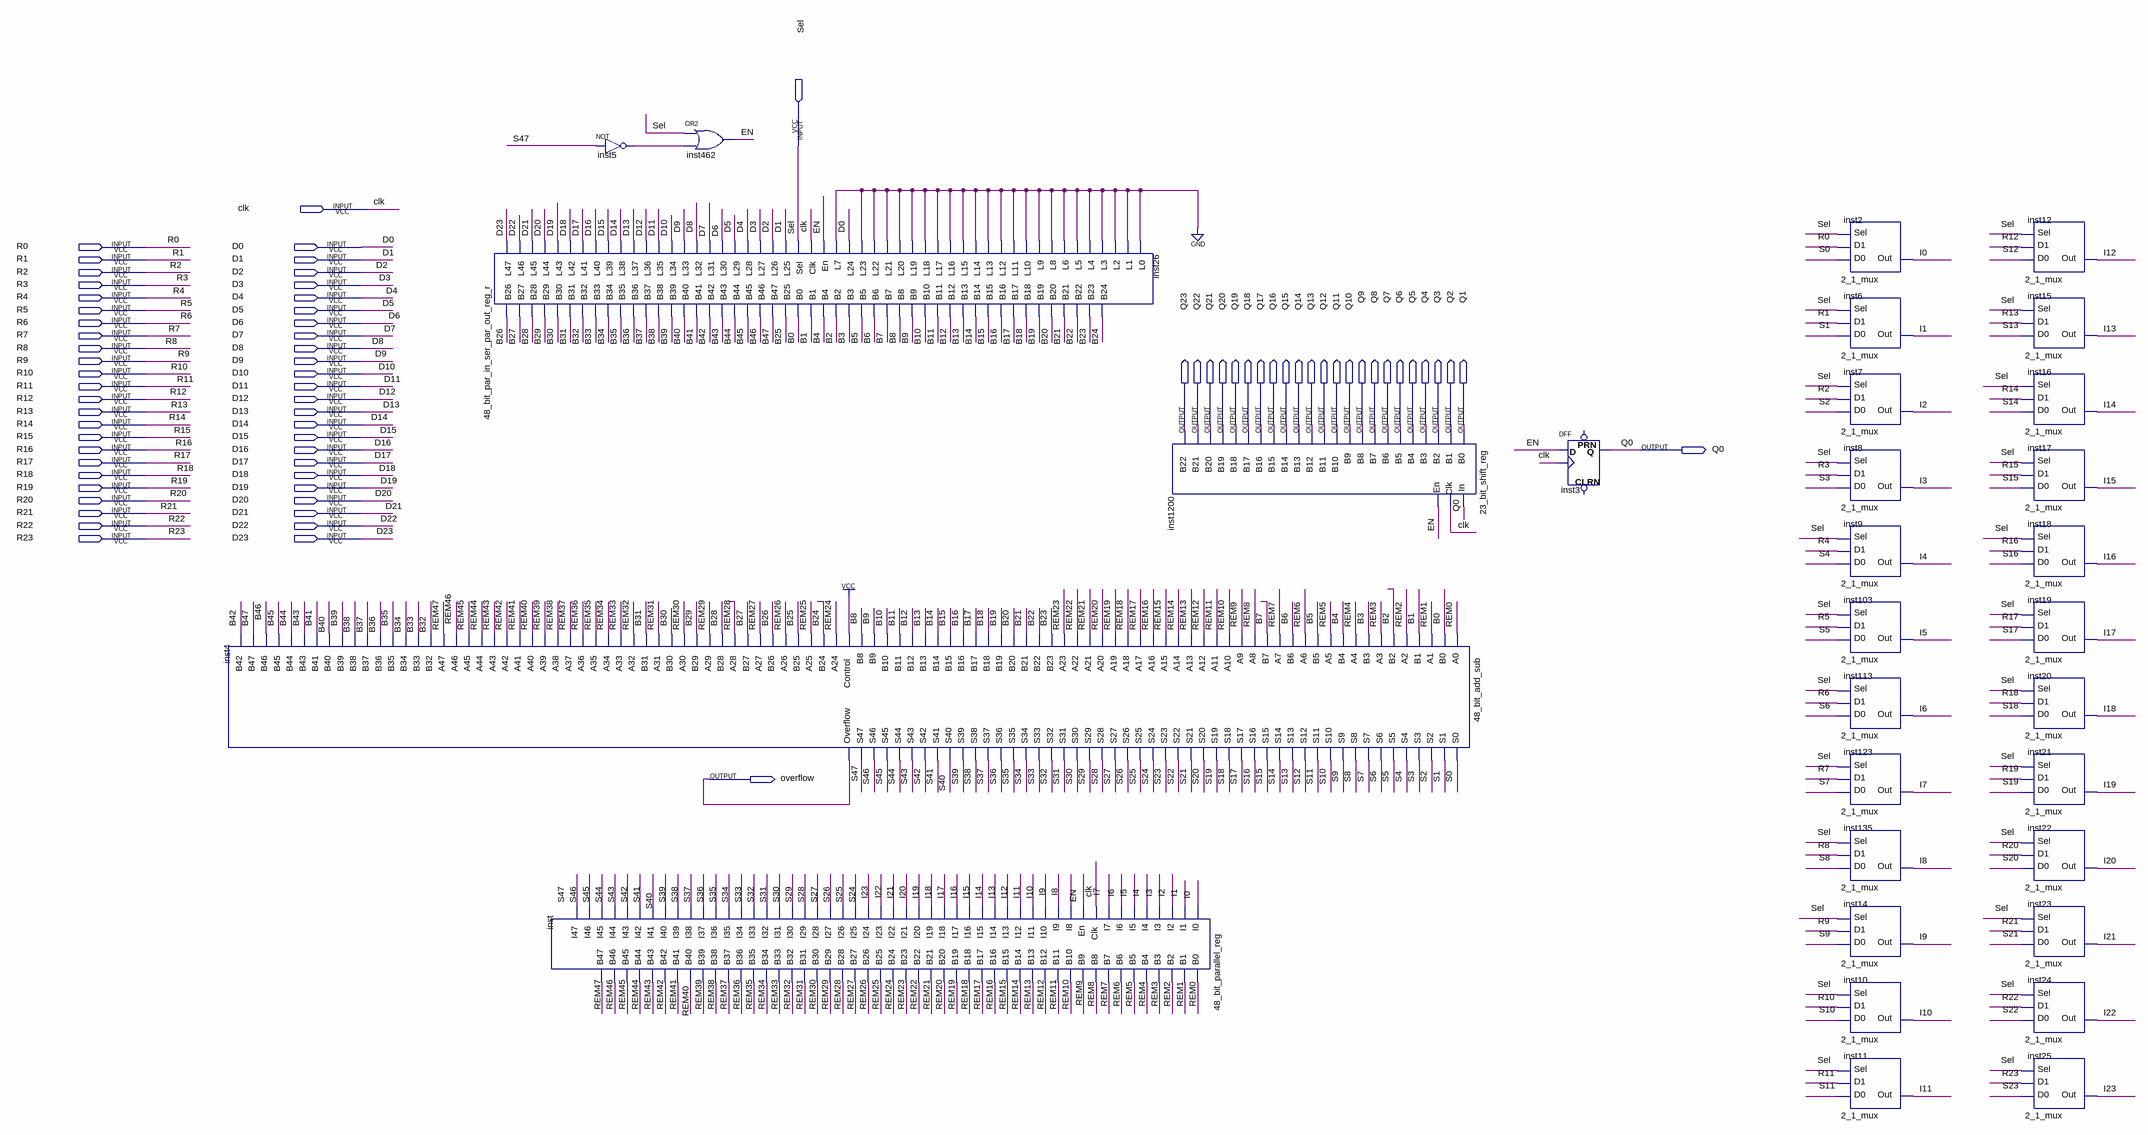
[diagram p0: schematic sheet]
// Quartus schematic Divider.bdf as structural Verilog: 31 symbols, 75 pins
module Divider (
  input  Sel,
  input  clk,
  input  R0,
  input  D0,
  input  R1,
  input  D1,
  input  R2,
  input  D2,
  input  R3,
  input  D3,
  input  R4,
  input  D4,
  input  R5,
  input  D5,
  input  R6,
  input  D6,
  input  R7,
  input  D7,
  input  R8,
  input  D8,
  input  R9,
  input  D9,
  input  R10,
  input  D10,
  input  R11,
  input  D11,
  input  R12,
  input  D12,
  input  R13,
  input  D13,
  input  R14,
  input  D14,
  input  R15,
  input  D15,
  input  R16,
  input  D16,
  input  R17,
  input  D17,
  input  R18,
  input  D18,
  input  R19,
  input  D19,
  input  R20,
  input  D20,
  input  R21,
  input  D21,
  input  R22,
  input  D22,
  input  R23,
  input  D23,
  output Q23,
  output Q22,
  output Q21,
  output Q20,
  output Q19,
  output Q18,
  output Q17,
  output Q16,
  output Q15,
  output Q14,
  output Q13,
  output Q12,
  output Q11,
  output Q10,
  output Q9,
  output Q8,
  output Q7,
  output Q6,
  output Q5,
  output Q4,
  output Q3,
  output Q2,
  output Q1,
  output Q0,
  output overflow
);

  wire B0, B1, B2, B3, B4, B5, B6, B7, B8, B9, B10, B11, B12, B13, B14, B15, B16, B17, B18, B19, B20, B21,
       B22, B23, B24, B25, B26, B27, B28, B29, B30, B31, B32, B33, B34, B35, B36, B37, B38, B39, B40, B41,
       B42, B43, B44, B45, B46, B47, EN, I0, I1, I2, I3, I4, I5, I6, I7, I8, I9, I10, I11, I12, I13, I14,
       I15, I16, I17, I18, I19, I20, I21, I22, I23, inst5_out, REM0, REM1, REM2, REM3, REM4, REM5, REM6,
       REM7, REM8, REM9, REM10, REM11, REM12, REM13, REM14, REM15, REM16, REM17, REM18, REM19, REM20, REM21,
       REM22, REM23, REM24, REM25, REM26, REM27, REM28, REM29, REM30, REM31, REM32, REM33, REM34, REM35,
       REM36, REM37, REM38, REM39, REM40, REM41, REM42, REM43, REM44, REM45, REM46, REM47, S0, S1, S2, S3,
       S4, S5, S6, S7, S8, S9, S10, S11, S12, S13, S14, S15, S16, S17, S18, S19, S20, S21, S22, S23, S24,
       S25, S26, S27, S28, S29, S30, S31, S32, S33, S34, S35, S36, S37, S38, S39, S40, S41, S42, S43, S44,
       S45, S46, S47;

  \48_bit_add_sub  inst4 (
    .A0(REM0), .B0(B0), .A1(REM1), .B1(B1), .A2(REM2), .B2(B2), .A3(REM3), .B3(B3), .A4(REM4), .B4(B4),
    .A5(REM5), .B5(B5), .A6(REM6), .B6(B6), .A7(REM7), .B7(B7), .A8(REM8), .A9(REM9), .A10(REM10),
    .A11(REM11), .A12(REM12), .A13(REM13), .A14(REM14), .A15(REM15), .A16(REM16), .A17(REM17), .A18(REM18),
    .A19(REM19), .A20(REM20), .A21(REM21), .A22(REM22), .A23(REM23), .B23(B23), .B22(B22), .B21(B21),
    .B20(B20), .B19(B19), .B18(B18), .B17(B17), .B16(B16), .B15(B15), .B14(B14), .B13(B13), .B12(B12),
    .B11(B11), .B10(B10), .B9(B9), .B8(B8), .Control(1'b1), .A24(REM24), .B24(B24), .A25(REM25), .B25(B25),
    .A26(REM26), .B26(B26), .A27(REM27), .B27(B27), .A28(REM28), .B28(B28), .A29(REM29), .B29(B29),
    .A30(REM30), .B30(B30), .A31(REM31), .B31(B31), .A32(REM32), .A33(REM33), .A34(REM34), .A35(REM35),
    .A36(REM36), .A37(REM37), .A38(REM38), .A39(REM39), .A40(REM40), .A41(REM41), .A42(REM42), .A43(REM43),
    .A44(REM44), .A45(REM45), .A46(REM46), .A47(REM47), .B32(B32), .B33(B33), .B34(B34), .B35(B35),
    .B36(B36), .B37(B37), .B38(B38), .B39(B39), .B40(B40), .B41(B41), .B43(B43), .B44(B44), .B45(B45),
    .B46(B46), .B47(B47), .B42(B42), .S0(S0), .S1(S1), .S2(S2), .S3(S3), .S4(S4), .S5(S5), .S6(S6), .S7(S7),
    .S8(S8), .S9(S9), .S10(S10), .S11(S11), .S12(S12), .S13(S13), .S14(S14), .S15(S15), .S16(S16), .S17(S17),
    .S18(S18), .S19(S19), .S20(S20), .S21(S21), .S22(S22), .S23(S23), .S24(S24), .S25(S25), .S26(S26),
    .S27(S27), .S28(S28), .S29(S29), .S30(S30), .S31(S31), .S32(S32), .S33(S33), .S34(S34), .S35(S35),
    .S36(S36), .S37(S37), .S38(S38), .S39(S39), .S40(S40), .S41(S41), .S42(S42), .S43(S43), .S44(S44),
    .S45(S45), .S46(S46), .S47(S47), .Overflow(overflow));
  \48_bit_par_in_ser_par_out_reg_r  inst26 (
    .L47(D23), .L46(D22), .L45(D21), .L44(D20), .L43(D19), .L42(D18), .L41(D17), .L40(D16), .L39(D15),
    .L38(D14), .L37(D13), .L36(D12), .L35(D11), .L34(D10), .L33(D9), .L32(D8), .L31(D7), .L30(D6), .L29(D5),
    .L28(D4), .L27(D3), .L26(D2), .L25(D1), .Sel(Sel), .Clk(clk), .En(EN), .L7(1'b0), .L24(D0), .L23(1'b0),
    .L22(1'b0), .L21(1'b0), .L20(1'b0), .L19(1'b0), .L18(1'b0), .L17(1'b0), .L16(1'b0), .L15(1'b0),
    .L14(1'b0), .L13(1'b0), .L12(1'b0), .L11(1'b0), .L10(1'b0), .L9(1'b0), .L8(1'b0), .L6(1'b0), .L5(1'b0),
    .L4(1'b0), .L3(1'b0), .L2(1'b0), .L1(1'b0), .L0(1'b0), .B26(B26), .B27(B27), .B28(B28), .B29(B29),
    .B30(B30), .B31(B31), .B32(B32), .B33(B33), .B34(B34), .B35(B35), .B36(B36), .B37(B37), .B38(B38),
    .B39(B39), .B40(B40), .B41(B41), .B42(B42), .B43(B43), .B44(B44), .B45(B45), .B46(B46), .B47(B47),
    .B25(B25), .B0(B0), .B1(B1), .B4(B4), .B2(B2), .B3(B3), .B5(B5), .B6(B6), .B7(B7), .B8(B8), .B9(B9),
    .B10(B10), .B11(B11), .B12(B12), .B13(B13), .B14(B14), .B15(B15), .B16(B16), .B17(B17), .B18(B18),
    .B19(B19), .B20(B20), .B21(B21), .B22(B22), .B23(B23), .B24(B24));
  \48_bit_parallel_reg  inst (
    .I0(I0), .I1(I1), .I2(I2), .I3(I3), .I4(I4), .I5(I5), .I6(I6), .I7(I7), .Clk(clk), .En(EN), .I8(I8),
    .I9(I9), .I10(I10), .I11(I11), .I12(I12), .I13(I13), .I14(I14), .I15(I15), .I16(I16), .I17(I17),
    .I18(I18), .I19(I19), .I20(I20), .I21(I21), .I22(I22), .I23(I23), .I24(S24), .I25(S25), .I26(S26),
    .I27(S27), .I28(S28), .I29(S29), .I30(S30), .I31(S31), .I32(S32), .I33(S33), .I34(S34), .I35(S35),
    .I36(S36), .I37(S37), .I38(S38), .I39(S39), .I40(S40), .I41(S41), .I42(S42), .I43(S43), .I44(S44),
    .I45(S45), .I46(S46), .I47(S47), .B0(REM0), .B1(REM1), .B2(REM2), .B3(REM3), .B4(REM4), .B5(REM5),
    .B6(REM6), .B7(REM7), .B8(REM8), .B9(REM9), .B10(REM10), .B11(REM11), .B12(REM12), .B13(REM13),
    .B14(REM14), .B15(REM15), .B16(REM16), .B17(REM17), .B18(REM18), .B19(REM19), .B20(REM20), .B21(REM21),
    .B22(REM22), .B23(REM23), .B24(REM24), .B25(REM25), .B26(REM26), .B27(REM27), .B28(REM28), .B29(REM29),
    .B30(REM30), .B31(REM31), .B32(REM32), .B33(REM33), .B34(REM34), .B35(REM35), .B36(REM36), .B37(REM37),
    .B38(REM38), .B39(REM39), .B40(REM40), .B41(REM41), .B42(REM42), .B43(REM43), .B44(REM44), .B45(REM45),
    .B46(REM46), .B47(REM47));
  not inst5 (inst5_out, S47);
  or inst462 (EN, Sel, inst5_out);
  \23_bit_shift_reg  inst1200 (
    .In(Q0), .Clk(clk), .En(EN), .B0(Q1), .B1(Q2), .B2(Q3), .B3(Q4), .B4(Q5), .B5(Q6), .B6(Q7), .B7(Q8),
    .B8(Q9), .B9(Q10), .B10(Q11), .B11(Q12), .B12(Q13), .B13(Q14), .B14(Q15), .B15(Q16), .B16(Q17),
    .B17(Q18), .B18(Q19), .B19(Q20), .B20(Q21), .B21(Q22), .B22(Q23));
  DFF inst3 (.CLK(clk), .D(EN), .Q(Q0));  // open: CLRN, PRN
  \2_1_mux  inst2 (.D0(S0), .D1(R0), .Sel(Sel), .Out(I0));
  \2_1_mux  inst6 (.D0(S1), .D1(R1), .Sel(Sel), .Out(I1));
  \2_1_mux  inst7 (.D0(S2), .D1(R2), .Sel(Sel), .Out(I2));
  \2_1_mux  inst8 (.D0(S3), .D1(R3), .Sel(Sel), .Out(I3));
  \2_1_mux  inst9 (.D0(S4), .D1(R4), .Sel(Sel), .Out(I4));
  \2_1_mux  inst103 (.D0(S5), .D1(R5), .Sel(Sel), .Out(I5));
  \2_1_mux  inst113 (.D0(S6), .D1(R6), .Sel(Sel), .Out(I6));
  \2_1_mux  inst123 (.D0(S7), .D1(R7), .Sel(Sel), .Out(I7));
  \2_1_mux  inst135 (.D0(S8), .D1(R8), .Sel(Sel), .Out(I8));
  \2_1_mux  inst14 (.D0(S9), .D1(R9), .Sel(Sel), .Out(I9));
  \2_1_mux  inst10 (.D0(S10), .D1(R10), .Sel(Sel), .Out(I10));
  \2_1_mux  inst11 (.D0(S11), .D1(R11), .Sel(Sel), .Out(I11));
  \2_1_mux  inst12 (.D0(S12), .D1(R12), .Sel(Sel), .Out(I12));
  \2_1_mux  inst15 (.D0(S13), .D1(R13), .Sel(Sel), .Out(I13));
  \2_1_mux  inst16 (.D0(S14), .D1(R14), .Sel(Sel), .Out(I14));
  \2_1_mux  inst17 (.D0(S15), .D1(R15), .Sel(Sel), .Out(I15));
  \2_1_mux  inst18 (.D0(S16), .D1(R16), .Sel(Sel), .Out(I16));
  \2_1_mux  inst19 (.D0(S17), .D1(R17), .Sel(Sel), .Out(I17));
  \2_1_mux  inst20 (.D0(S18), .D1(R18), .Sel(Sel), .Out(I18));
  \2_1_mux  inst21 (.D0(S19), .D1(R19), .Sel(Sel), .Out(I19));
  \2_1_mux  inst22 (.D0(S20), .D1(R20), .Sel(Sel), .Out(I20));
  \2_1_mux  inst23 (.D0(S21), .D1(R21), .Sel(Sel), .Out(I21));
  \2_1_mux  inst24 (.D0(S22), .D1(R22), .Sel(Sel), .Out(I22));
  \2_1_mux  inst25 (.D0(S23), .D1(R23), .Sel(Sel), .Out(I23));
endmodule
